# Altium schematic sheet caton-self-test.SchDoc
size A; SheetNumber: 4; SheetTotal: 4
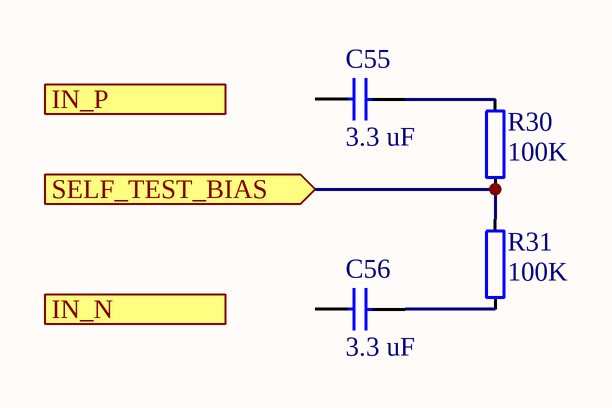
[diagram p0: caton-self-test.SchDoc]

## Parts
C55  3.3 uF  [0402]
C56  3.3 uF  [0402]
R30  100K  [0402]
R31  100K  [0402]

## Ports
IN_N (in), IN_P (in), SELF_TEST_BIAS (in)

## Nets
SELF_TEST_BIAS: R30.1 R31.2 ; port SELF_TEST_BIAS
NetC55_2: C55.2 R30.2
NetC56_2: C56.2 R31.1

Not connected (* = marked no-connect by the designer): C55 1; C56 1

## Library data of the parts
C55 C56 = C0402: Capacitor, 0402, X5R, ±20%; Part Number: C0402-4µ7; Manufacturer: N.A.; Part number IPS: 00000001251, 00000007165; Note: 10V; Artikkelnr Noca: 20039482; Pad Count: 2; Manufacturer Part Number: N.A.; LatestRevisionDate: 2017-11-09; Published: 2009-05-08; Value: 3.3 uF; Footprint Doc: 0402; ComponentLink1Description: Datasheet; ComponentLink1URL: N.A.; ComponentLink2Description: Supplier link; ComponentLink2URL: N.A.; HelpURL: N.A.; Supplier 1: Digi-Key; Supplier Part Number 1: 490-13252-1-ND; Supplier 2: N.A.; Supplier Part Number 2: N.A.; PartId: 100200193; Component Class: Capacitors; Author: rsk; Part number Norautron: N.A.
R30 R31 = R0402: Resistor, 0402, ±1%, 0.05W; Part Number: R0201-10k; Manufacturer: N.A.; Part number IPS: 00000001255; Note: Chip Res 1%; Pad Count: 2; Manufacturer Part Number: N.A.; LatestRevisionDate: 2014-11-13; Published: 2014-11-13; Value: 100K; Artikkelnr Noca: N.A.; Footprint Doc: 0201; ComponentLink1Description: Datasheet; ComponentLink1URL: N.A.; ComponentLink2Description: Supplier link; ComponentLink2URL: N.A.; HelpURL: N.A.; Supplier 1: N.A.; Supplier Part Number 1: N.A.; Supplier 2: N.A.; Supplier Part Number 2: N.A.; PartId: 100100065; Component Class: Resistors; Author: rsk; Part number Norautron: N.A.